# Altium schematic sheet 04_RPI_CAMERA.SchDoc
size A4; Revision: A
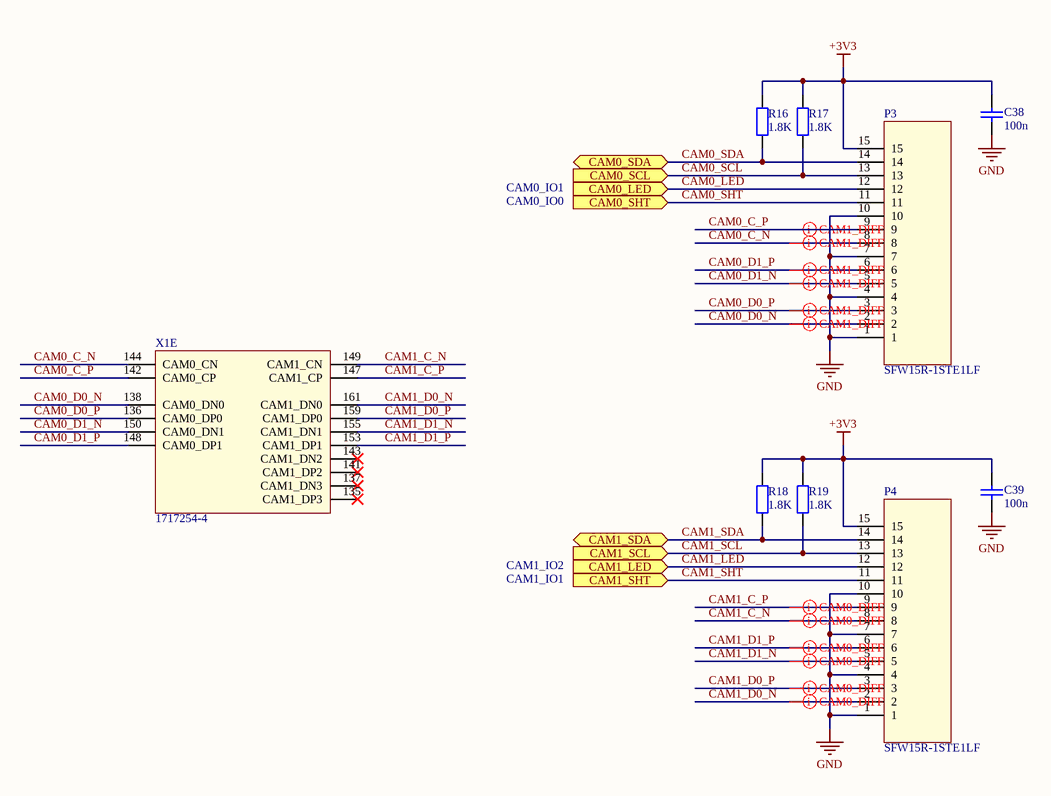
[diagram p0: 04_RPI_CAMERA.SchDoc]

## Parts
C38  100n  [C0603_IPC_HD]
C39  100n  [C0603_IPC_HD]
P3  SFW15R-1STE1LF  [SFW15R-1STE1LF]
P4  SFW15R-1STE1LF  [SFW15R-1STE1LF]
R16  1.8K  [R0603_IPC_MD]
R17  1.8K  [R0603_IPC_MD]
R18  1.8K  [R0603_IPC_MD]
R19  1.8K  [R0603_IPC_MD]
X1  1717254-4  [1717254-1]  (part E of 7)

## Ports
CAM0_LED (in), CAM0_SCL (in), CAM0_SDA (bidir), CAM0_SHT (in), CAM1_LED (in), CAM1_SCL (in), CAM1_SDA (bidir), CAM1_SHT (in)

## Nets
+3V3: C38.2 C39.2 P3.15 P4.15 R16.2 R17.2 R18.2 R19.2
GND: C38.1 C39.1 P3.1 P3.4 P3.7 P3.10 P4.1 P4.4 P4.7 P4.10
CAM0_C_N: P3.8 X1.144(CAM0_CN)
CAM0_C_P: P3.9 X1.142(CAM0_CP)
CAM0_D0_N: P3.2 X1.138(CAM0_DN0)
CAM0_D0_P: P3.3 X1.136(CAM0_DP0)
CAM0_D1_N: P3.5 X1.150(CAM0_DN1)
CAM0_D1_P: P3.6 X1.148(CAM0_DP1)
CAM0_LED: P3.12 ; port CAM0_LED
CAM0_SCL: P3.13 R17.1 ; port CAM0_SCL
CAM0_SDA: P3.14 R16.1 ; port CAM0_SDA
CAM0_SHT: P3.11 ; port CAM0_SHT
CAM1_C_N: P4.8 X1.149(CAM1_CN)
CAM1_C_P: P4.9 X1.147(CAM1_CP)
CAM1_D0_N: P4.2 X1.161(CAM1_DN0)
CAM1_D0_P: P4.3 X1.159(CAM1_DP0)
CAM1_D1_N: P4.5 X1.155(CAM1_DN1)
CAM1_D1_P: P4.6 X1.153(CAM1_DP1)
CAM1_LED: P4.12 ; port CAM1_LED
CAM1_SCL: P4.13 R19.1 ; port CAM1_SCL
CAM1_SDA: P4.14 R18.1 ; port CAM1_SDA
CAM1_SHT: P4.11 ; port CAM1_SHT

Not connected (* = marked no-connect by the designer): X1 135(CAM1_DP3)* 137(CAM1_DN3)* 141(CAM1_DP2)* 143(CAM1_DN2)*

## Layout directives
differential pair: CAM0_C_N, CAM0_C_P, CAM0_D0_N, CAM0_D0_P, CAM0_D1_N, CAM0_D1_P, CAM1_C_N, CAM1_C_P, CAM1_D0_N, CAM1_D0_P, CAM1_D1_N, CAM1_D1_P

## Notes on the sheet
- CAM0_IO0
- CAM0_IO1
- CAM1_IO1
- CAM1_IO2
- Title
- Size:
- Date:
- A4
- Number:
- Time:
- Revision:
- Sheet
- of
- File:

## Library data of the parts
C38 C39 = CL10B104KO8NNNC: CAP CER 0.1UF 16V X7R 0603; Manufacturer: Samsung Electro-Mechanics; Manufacturer Part Number: CL10B104KO8NNNC; Voltage: 16V; Value: 100n; Dielectric: X7R; Supplier 1: Digi-Key; Supplier Part Number 1: 1276-1005-1-ND
P3 P4 = SFW15R-1STE1LF: CONN FFC BOTTOM 15POS 1.00MM R/A; Manufacturer: Amphenol ICC (FCI); Manufacturer Part Number: SFW15R-1STE1LF; Supplier 1: Digi-Key; Supplier Part Number 1: 609-1905-1-ND
R16-R19 = CR0603-JW-182ELF: RES SMD 1.8K OHM 5% 1/10W 0603; Manufacturer: Bourns Inc.; Value: 1.8K; Tolarance: 5%; Manufacturer Part Number: CR0603-JW-182ELF; Supplier 1: Digi-Key; Supplier Part Number 1: CR0603-JW-182ELFCT-ND
X1 = Raspberry CM Connector: CONN SKT SODIMM 200POS R/A SMD; Manufacturer: TE Connectivity AMP Connectors; Manufacturer Part Number: 1717254-4; Supplier 1: Digi-Key; Supplier Part Number 1: A130932CT-ND